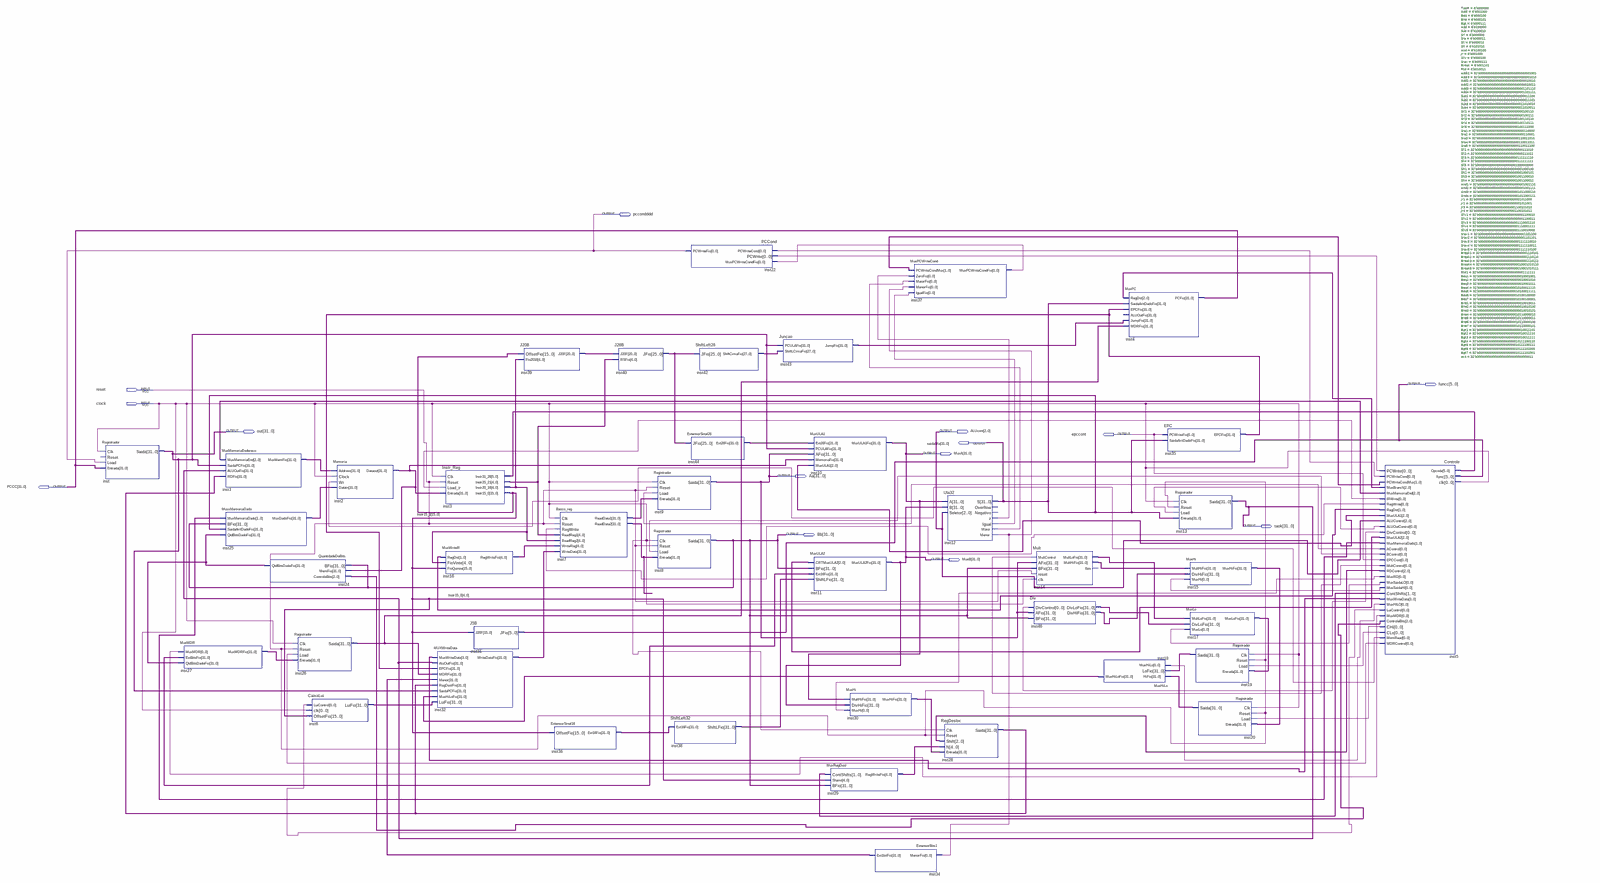
[diagram p0: schematic sheet, whole]
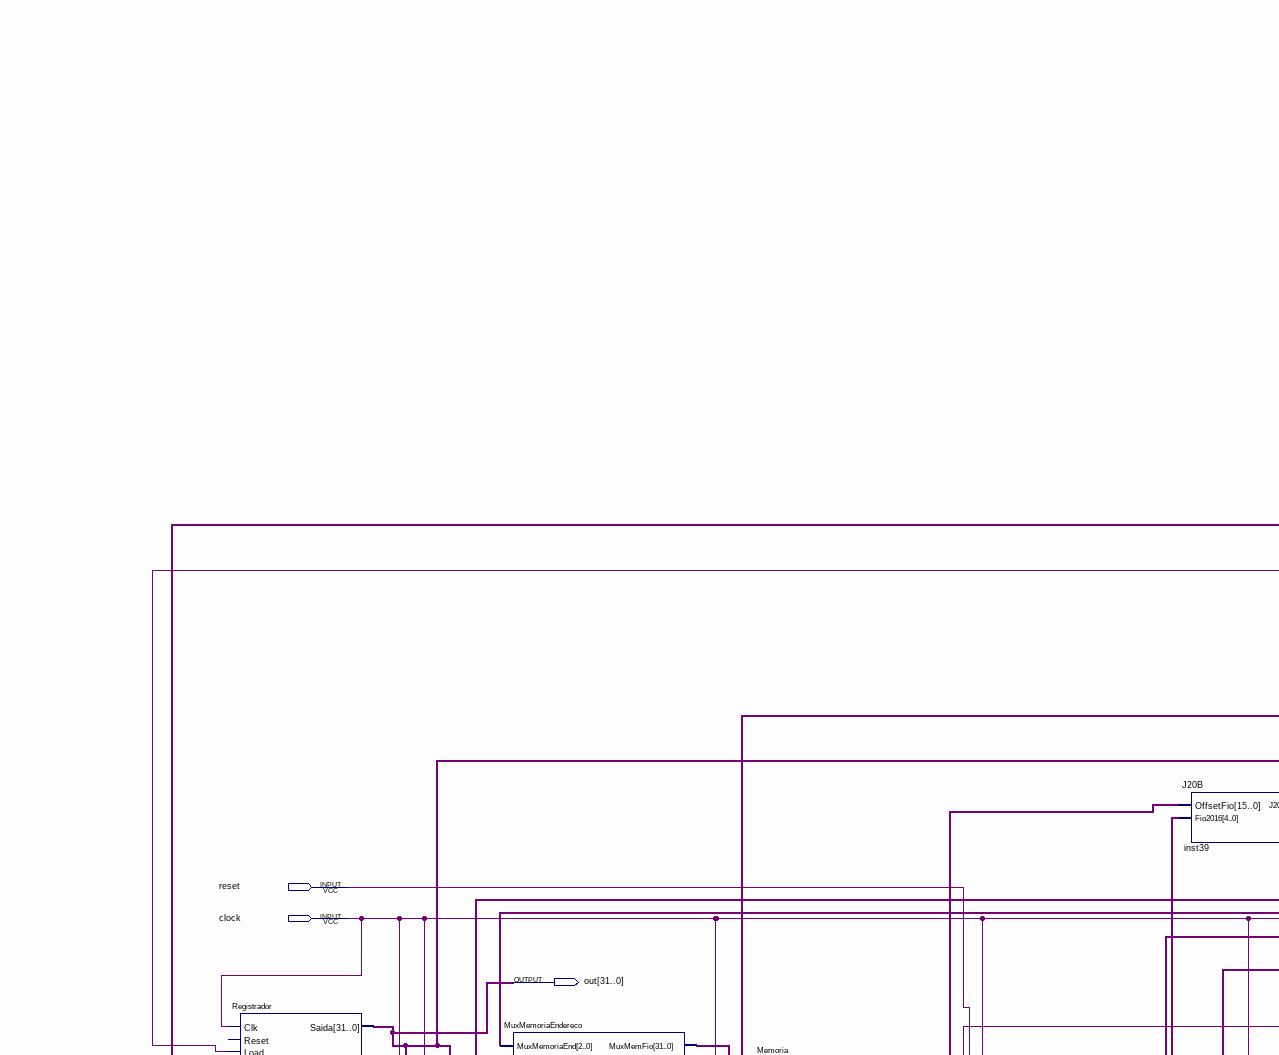
[diagram p1: schematic sheet, upper left part]
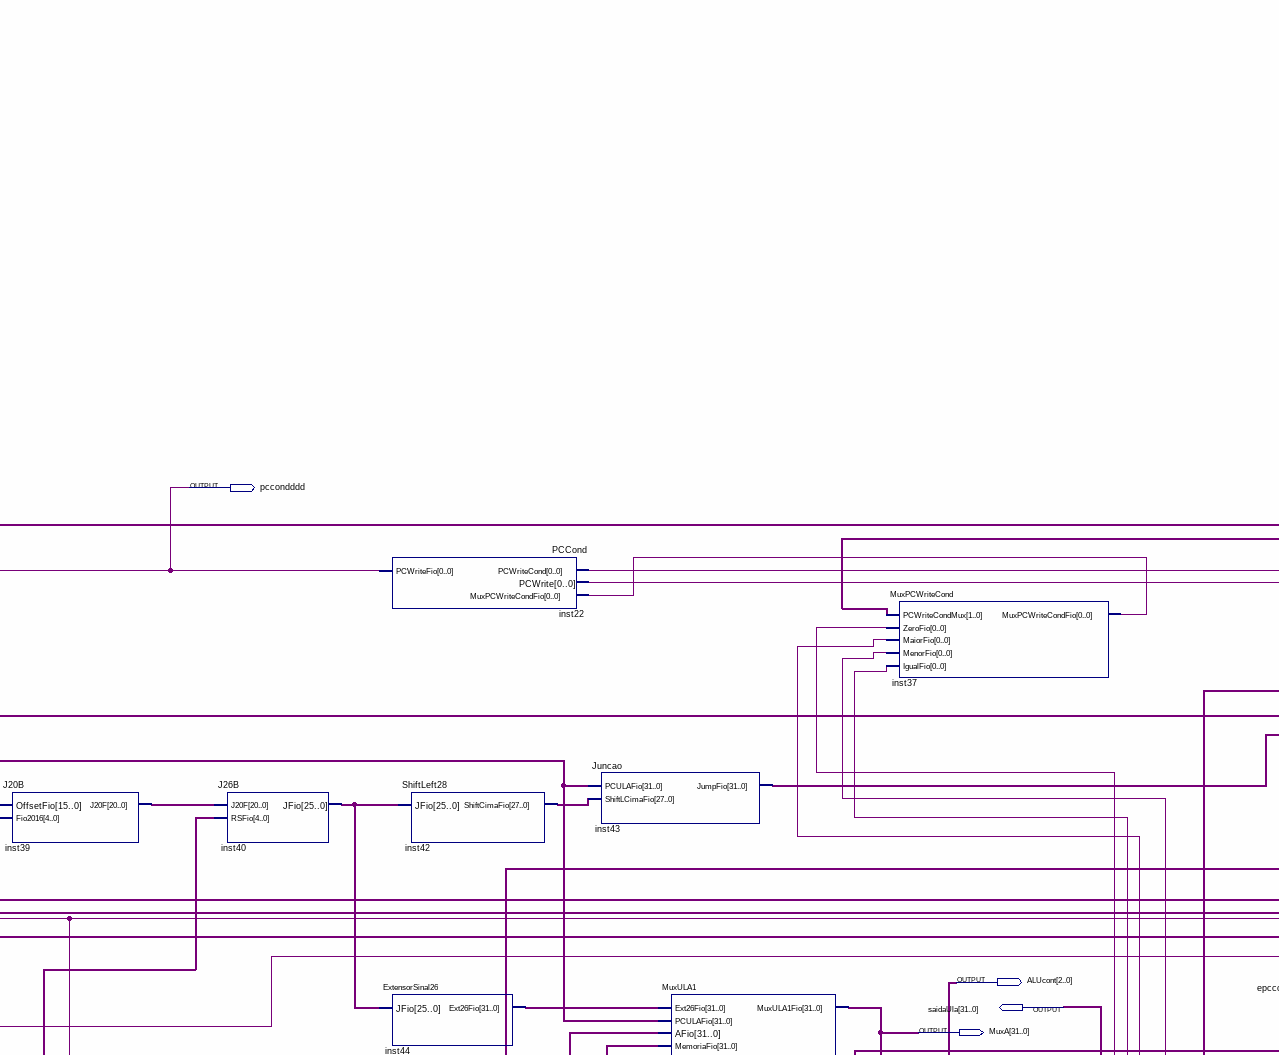
[diagram p2: schematic sheet, upper centre part]
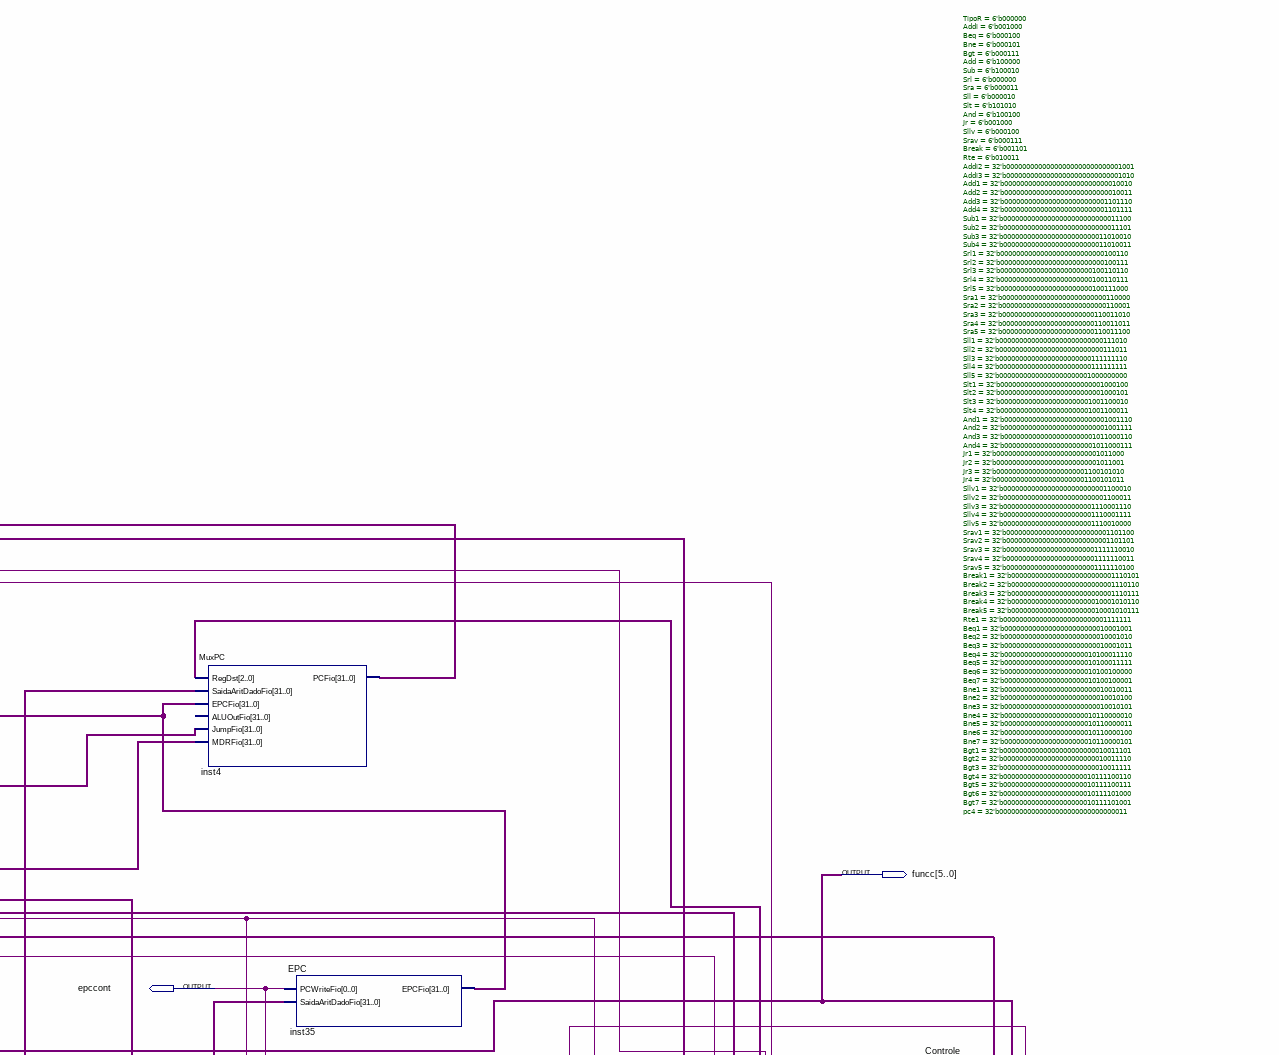
[diagram p3: schematic sheet, upper right part]
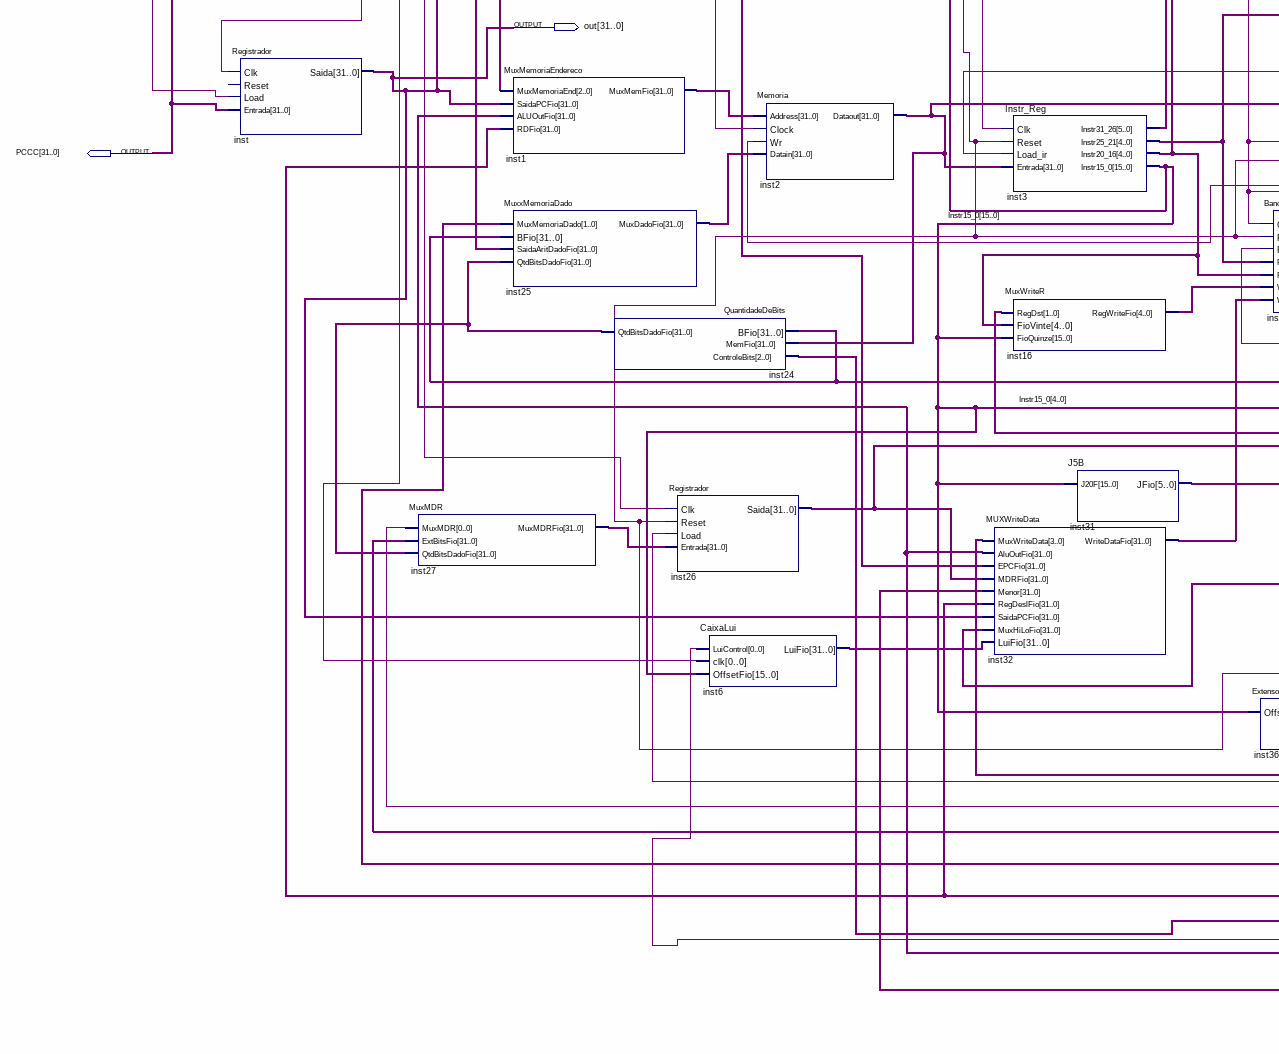
[diagram p4: schematic sheet, lower left part]
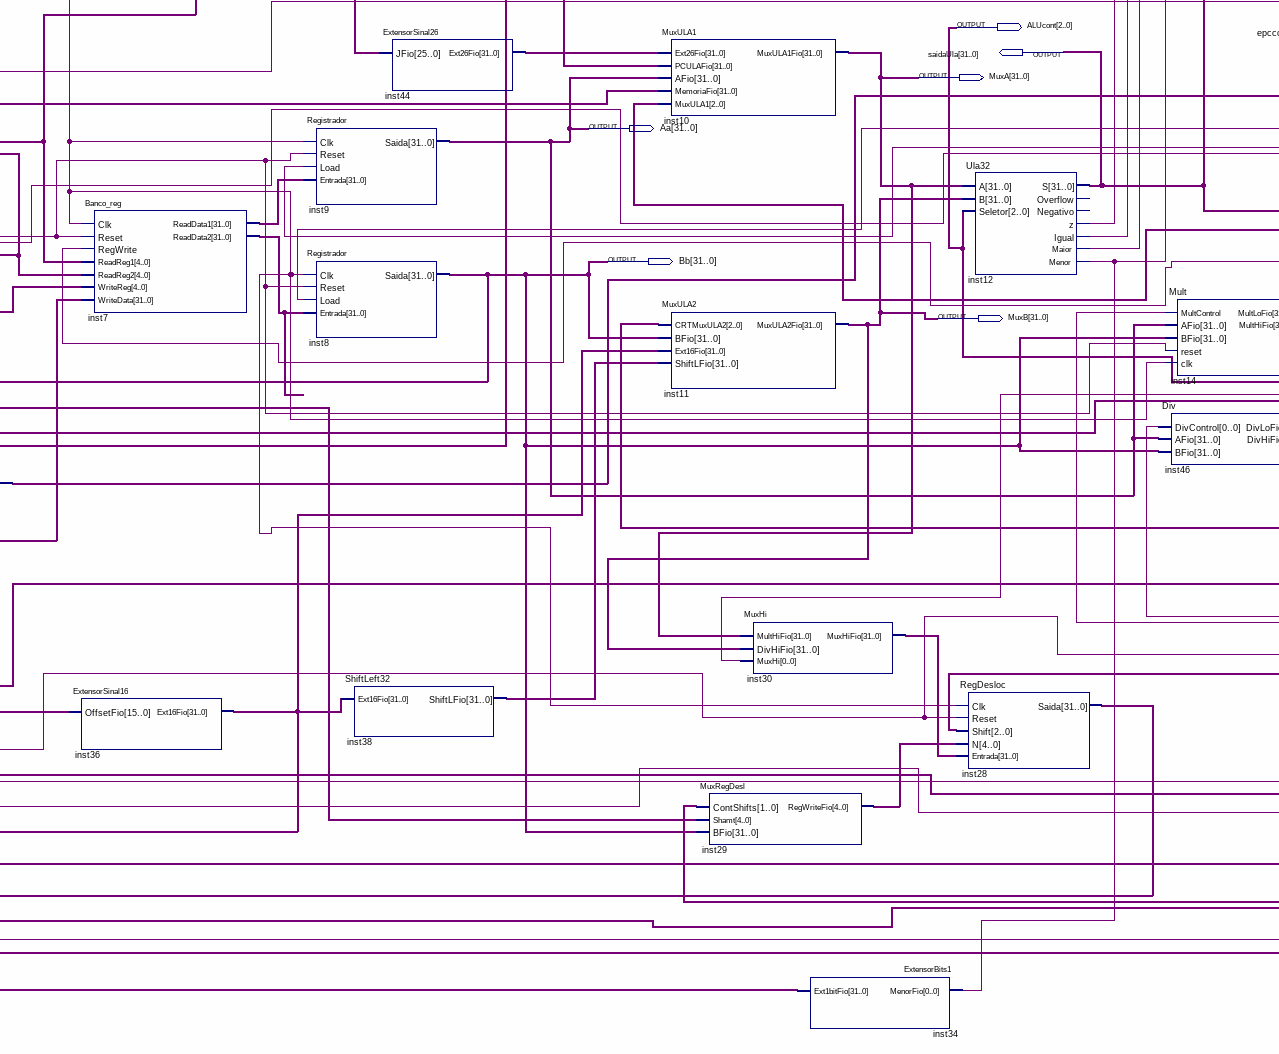
[diagram p5: schematic sheet, lower centre part]
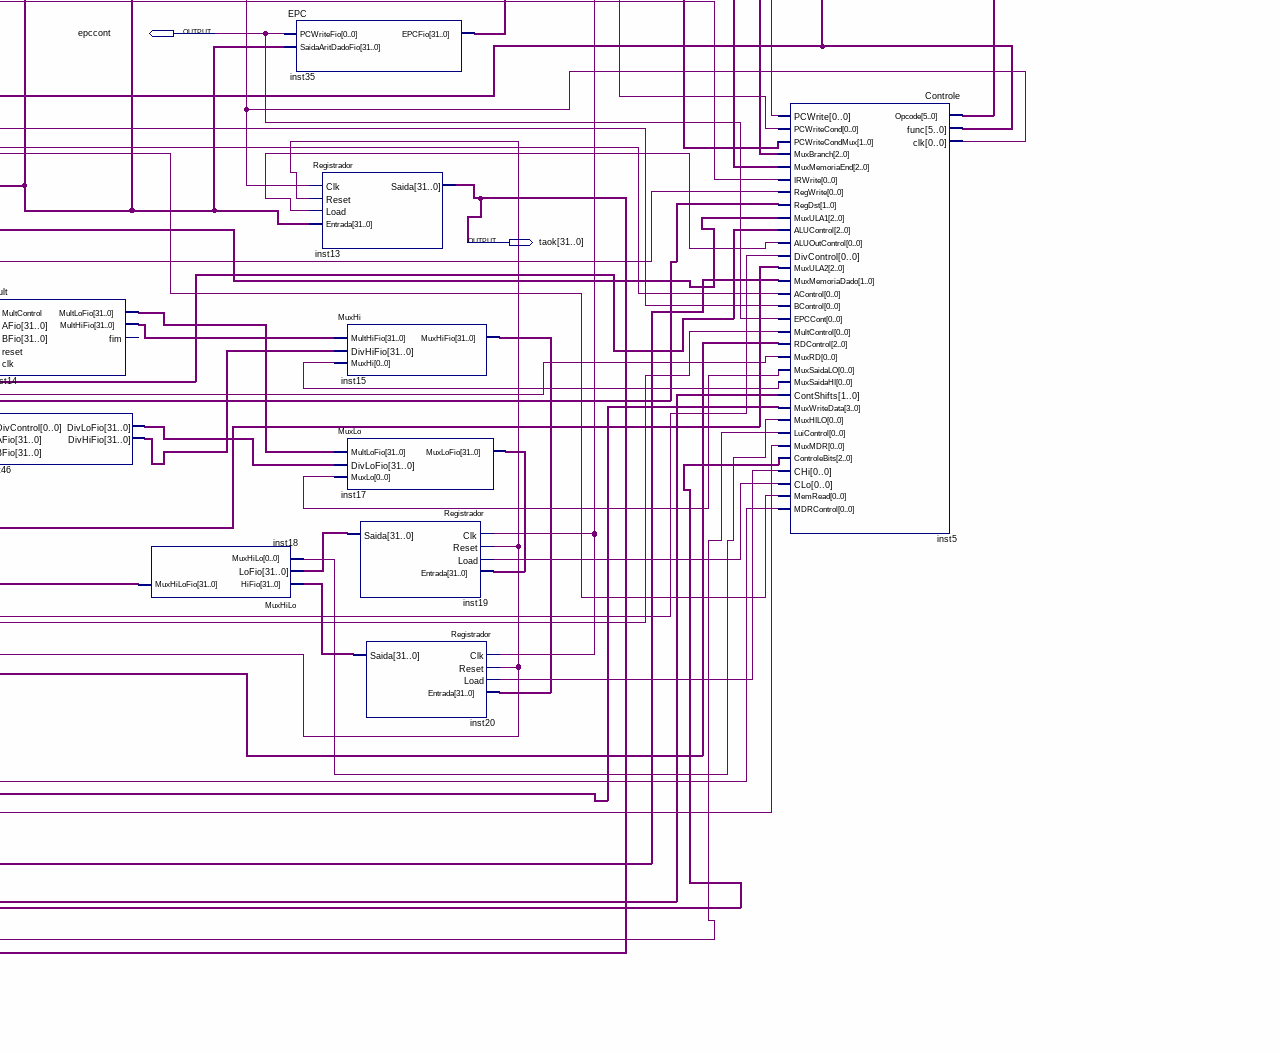
[diagram p6: schematic sheet, lower right part]
// Quartus schematic CPU.bdf as structural Verilog: 42 symbols, 14 pins
module CPU (
  input  reset,
  input  clock,
  output pccondddd,
  output [5:0] funcc,
  output [31:0] out,
  output [2:0] ALUcont,
  output epccont,
  output [31:0] saidaUla,
  output [31:0] MuxA,
  output [31:0] Aa,
  output [31:0] PCCC,
  output [31:0] taok,
  output [31:0] Bb,
  output [31:0] MuxB
);

  wire inst5_acontrol, inst5_aluoutcontrol, inst5_bcontrol, inst5_chi, inst5_clo, inst5_divcontrol,
       inst5_irwrite, inst5_luicontrol, inst5_mdrcontrol, inst5_memread, inst5_multcontrol, inst5_muxhilo,
       inst5_muxmdr, inst5_muxrd, inst5_muxsaidahi, inst5_muxsaidalo, inst5_pcwrite, inst5_pcwritecond,
       inst5_regwrite, inst12_igual, inst12_maior, inst12_menor, inst12_z, inst37_muxpcwritecondfio;
  wire [1:0] inst5_contshifts, inst5_muxmemoriadado, inst5_pcwritecondmux, inst5_regdst;
  wire [2:0] inst5_controlebits, inst5_muxbranch, inst5_muxmemoriaend, inst5_muxula1, inst5_muxula2,
       inst5_rdcontrol;
  wire [3:0] inst5_muxwritedata;
  wire [4:0] inst3_instr20_16, inst3_instr25_21, inst16_regwritefio, inst29_regwritefio;
  wire [5:0] inst3_instr31_26;
  wire [15:0] Instr15_0;
  wire [20:0] inst39_j20f;
  wire [25:0] inst40_jfio;
  wire [27:0] inst42_shiftcimafio;
  wire [31:0] inst1_muxmemfio, inst2_dataout, inst6_luifio, inst7_readdata1, inst7_readdata2,
       inst14_multhifio, inst14_multlofio, inst15_muxhifio, inst17_muxlofio, inst18_muxhilofio, inst19_saida,
       inst20_saida, inst24_qtdbitsdadofio, inst25_muxdadofio, inst26_saida, inst27_muxmdrfio, inst28_saida,
       inst30_muxhifio, inst32_writedatafio, inst34_ext1bitfio, inst35_epcfio, inst36_ext16fio,
       inst38_shiftlfio, inst43_jumpfio, inst44_ext26fio, inst46_divhifio, inst46_divlofio;

  Registrador inst (.Clk(clock), .Load(pccondddd), .Entrada(PCCC), .Saida(out));  // open: Reset
  MuxMDR inst27 (
    .MuxMDR(inst5_muxmdr), .ExtBitsFio(inst36_ext16fio), .QtdBitsDadoFio(inst24_qtdbitsdadofio),
    .MuxMDRFio(inst27_muxmdrfio));
  MuxMemoriaEndereco inst1 (
    .MuxMemoriaEnd(inst5_muxmemoriaend), .SaidaPCFio(out), .ALUOutFio(taok), .RDFio(inst28_saida),
    .MuxMemFio(inst1_muxmemfio));
  MuxxMemoriaDado inst25 (
    .MuxMemoriaDado(inst5_muxmemoriadado), .BFio(Bb), .SaidaAritDadoFio(saidaUla),
    .QtdBitsDadoFio(inst24_qtdbitsdadofio), .MuxDadoFio(inst25_muxdadofio));
  QuantidadeDeBits inst24 (
    .BFio(Bb), .MemFio(inst2_dataout), .ControleBits(inst5_controlebits),
    .QtdBitsDadoFio(inst24_qtdbitsdadofio));
  Registrador inst26 (
    .Clk(clock), .Reset(reset), .Load(inst5_mdrcontrol), .Entrada(inst27_muxmdrfio), .Saida(inst26_saida));
  CaixaLui inst6 (.LuiControl(inst5_luicontrol), .clk(clock), .OffsetFio(Instr15_0), .LuiFio(inst6_luifio));
  Memoria inst2 (
    .Address(inst1_muxmemfio), .Clock(clock), .Wr(inst5_memread), .Datain(inst25_muxdadofio),
    .Dataout(inst2_dataout));
  Instr_Reg inst3 (
    .Clk(clock), .Reset(reset), .Load_ir(inst5_irwrite), .Entrada(inst2_dataout),
    .Instr31_26(inst3_instr31_26), .Instr25_21(inst3_instr25_21), .Instr20_16(inst3_instr20_16),
    .Instr15_0(Instr15_0));
  MuxWriteR inst16 (
    .RegDst(inst5_regdst), .FioVinte(inst3_instr20_16), .FioQuinze(Instr15_0),
    .RegWriteFio(inst16_regwritefio));
  MUXWriteData inst32 (
    .MuxWriteData(inst5_muxwritedata), .AluOutFio(taok), .EPCFio(inst35_epcfio), .MDRFio(inst26_saida),
    .Menor(inst34_ext1bitfio), .RegDeslFio(inst28_saida), .SaidaPCFio(out), .MuxHiLoFio(inst18_muxhilofio),
    .LuiFio(inst6_luifio), .WriteDataFio(inst32_writedatafio));
  J5B inst31 (.J20F(Instr15_0), .JFio(funcc));
  J20B inst39 (.OffsetFio(Instr15_0), .Fio2016(inst3_instr20_16), .J20F(inst39_j20f));
  ExtensorSinal16 inst36 (.OffsetFio(Instr15_0), .Ext16Fio(inst36_ext16fio));
  Banco_reg inst7 (
    .Clk(clock), .Reset(reset), .RegWrite(inst5_regwrite), .ReadReg1(inst3_instr25_21),
    .ReadReg2(inst3_instr20_16), .WriteReg(inst16_regwritefio), .WriteData(inst32_writedatafio),
    .ReadData1(inst7_readdata1), .ReadData2(inst7_readdata2));
  J26B inst40 (.J20F(inst39_j20f), .RSFio(inst3_instr25_21), .JFio(inst40_jfio));
  Registrador inst9 (.Clk(clock), .Reset(reset), .Load(inst5_acontrol), .Entrada(inst7_readdata1), .Saida(Aa));
  Registrador inst8 (.Clk(clock), .Reset(reset), .Load(inst5_bcontrol), .Entrada(inst7_readdata2), .Saida(Bb));
  PCCond inst22 (
    .PCWriteCond(inst5_pcwritecond), .PCWrite(inst5_pcwrite), .MuxPCWriteCondFio(inst37_muxpcwritecondfio),
    .PCWriteFio(pccondddd));
  ExtensorSinal26 inst44 (.JFio(inst40_jfio), .Ext26Fio(inst44_ext26fio));
  ShiftLeft32 inst38 (.Ext16Fio(inst36_ext16fio), .ShiftLFio(inst38_shiftlfio));
  ShiftLeft28 inst42 (.JFio(inst40_jfio), .ShiftCimaFio(inst42_shiftcimafio));
  Juncao inst43 (.PCULAFio(out), .ShiftLCimaFio(inst42_shiftcimafio), .JumpFio(inst43_jumpfio));
  MuxULA1 inst10 (
    .Ext26Fio(inst44_ext26fio), .PCULAFio(out), .AFio(Aa), .MemoriaFio(inst2_dataout),
    .MuxULA1(inst5_muxula1), .MuxULA1Fio(MuxA));
  MuxULA2 inst11 (
    .CRTMuxULA2(inst5_muxula2), .BFio(Bb), .Ext16Fio(inst36_ext16fio), .ShiftLFio(inst38_shiftlfio),
    .MuxULA2Fio(MuxB));
  MuxRegDesl inst29 (
    .ContShifts(inst5_contshifts), .Shamt(Instr15_0[4:0]), .BFio(Bb), .RegWriteFio(inst29_regwritefio));
  MuxHi inst30 (.MultHiFio(MuxA), .DivHiFio(MuxB), .MuxHi(inst5_muxrd), .MuxHiFio(inst30_muxhifio));
  ExtensorBits1 inst34 (.MenorFio(inst12_menor), .Ext1bitFio(inst34_ext1bitfio));
  MuxPCWriteCond inst37 (
    .PCWriteCondMux(inst5_pcwritecondmux), .ZeroFio(inst12_z), .MaiorFio(inst12_maior),
    .MenorFio(inst12_menor), .IgualFio(inst12_igual), .MuxPCWriteCondFio(inst37_muxpcwritecondfio));
  Ula32 inst12 (
    .A(MuxA), .B(MuxB), .Seletor(ALUcont), .S(saidaUla), .z(inst12_z), .Igual(inst12_igual),
    .Maior(inst12_maior), .Menor(inst12_menor));  // open: Overflow, Negativo
  RegDesloc inst28 (
    .Clk(clock), .Reset(reset), .Shift(inst5_rdcontrol), .N(inst29_regwritefio), .Entrada(inst30_muxhifio),
    .Saida(inst28_saida));
  Mult inst14 (
    .MultControl(inst5_multcontrol), .AFio(Aa), .BFio(Bb), .reset(reset), .clk(clock),
    .MultLoFio(inst14_multlofio), .MultHiFio(inst14_multhifio));  // open: fim
  Div inst46 (
    .DivControl(inst5_divcontrol), .AFio(Aa), .BFio(Bb), .DivLoFio(inst46_divlofio),
    .DivHiFio(inst46_divhifio));
  MuxHiLo inst18 (.HiFio(inst20_saida), .LoFio(inst19_saida), .MuxHiLo(inst5_muxhilo), .MuxHiLoFio(inst18_muxhilofio));
  MuxPC inst4 (
    .RegDst(inst5_muxbranch), .SaidaAritDadoFio(saidaUla), .EPCFio(inst35_epcfio), .JumpFio(inst43_jumpfio),
    .MDRFio(inst26_saida), .PCFio(PCCC));  // open: ALUOutFio
  EPC inst35 (.PCWriteFio(epccont), .SaidaAritDadoFio(saidaUla), .EPCFio(inst35_epcfio));
  Registrador inst13 (.Clk(clock), .Reset(reset), .Load(inst5_aluoutcontrol), .Entrada(saidaUla), .Saida(taok));
  MuxHi inst15 (
    .MultHiFio(inst14_multhifio), .DivHiFio(inst46_divhifio), .MuxHi(inst5_muxsaidahi),
    .MuxHiFio(inst15_muxhifio));
  MuxLo inst17 (
    .MultLoFio(inst14_multlofio), .DivLoFio(inst46_divlofio), .MuxLo(inst5_muxsaidalo),
    .MuxLoFio(inst17_muxlofio));
  Registrador inst19 (.Clk(clock), .Reset(reset), .Load(inst5_clo), .Entrada(inst17_muxlofio), .Saida(inst19_saida));
  Registrador inst20 (.Clk(clock), .Reset(reset), .Load(inst5_chi), .Entrada(inst15_muxhifio), .Saida(inst20_saida));
  Controle #(.TipoR(6'b000000), .Addi(6'b001000), .Beq(6'b000100), .Bne(6'b000101), .Bgt(6'b000111), .Add(6'b100000), .Sub(6'b100010), .Srl(6'b000000), .Sra(6'b000011), .Sll(6'b000010), .Slt(6'b101010), .And(6'b100100), .Jr(6'b001000), .Sllv(6'b000100), .Srav(6'b000111), .Break(6'b001101), .Rte(6'b010011), .Addi2(32'b00000000000000000000000000001001), .Addi3(32'b00000000000000000000000000001010), .Add1(32'b00000000000000000000000000010010), .Add2(32'b00000000000000000000000000010011), .Add3(32'b00000000000000000000000001101110), .Add4(32'b00000000000000000000000001101111), .Sub1(32'b00000000000000000000000000011100), .Sub2(32'b00000000000000000000000000011101), .Sub3(32'b00000000000000000000000011010010), .Sub4(32'b00000000000000000000000011010011), .Srl1(32'b00000000000000000000000000100110), .Srl2(32'b00000000000000000000000000100111), .Srl3(32'b00000000000000000000000100110110), .Srl4(32'b00000000000000000000000100110111), .Srl5(32'b00000000000000000000000100111000), .Sra1(32'b00000000000000000000000000110000), .Sra2(32'b00000000000000000000000000110001), .Sra3(32'b00000000000000000000000110011010), .Sra4(32'b00000000000000000000000110011011), .Sra5(32'b00000000000000000000000110011100), .Sll1(32'b00000000000000000000000000111010), .Sll2(32'b00000000000000000000000000111011), .Sll3(32'b00000000000000000000000111111110), .Sll4(32'b00000000000000000000000111111111), .Sll5(32'b00000000000000000000001000000000), .Slt1(32'b00000000000000000000000001000100), .Slt2(32'b00000000000000000000000001000101), .Slt3(32'b00000000000000000000001001100010), .Slt4(32'b00000000000000000000001001100011), .And1(32'b00000000000000000000000001001110), .And2(32'b00000000000000000000000001001111), .And3(32'b00000000000000000000001011000110), .And4(32'b00000000000000000000001011000111), .Jr1(32'b00000000000000000000000001011000), .Jr2(32'b00000000000000000000000001011001), .Jr3(32'b00000000000000000000001100101010), .Jr4(32'b00000000000000000000001100101011), .Sllv1(32'b00000000000000000000000001100010), .Sllv2(32'b00000000000000000000000001100011), .Sllv3(32'b00000000000000000000001110001110), .Sllv4(32'b00000000000000000000001110001111), .Sllv5(32'b00000000000000000000001110010000), .Srav1(32'b00000000000000000000000001101100), .Srav2(32'b00000000000000000000000001101101), .Srav3(32'b00000000000000000000001111110010), .Srav4(32'b00000000000000000000001111110011), .Srav5(32'b00000000000000000000001111110100), .Break1(32'b00000000000000000000000001110101), .Break2(32'b00000000000000000000000001110110), .Break3(32'b00000000000000000000000001110111), .Break4(32'b00000000000000000000010001010110), .Break5(32'b00000000000000000000010001010111), .Rte1(32'b00000000000000000000000001111111), .Beq1(32'b00000000000000000000000010001001), .Beq2(32'b00000000000000000000000010001010), .Beq3(32'b00000000000000000000000010001011), .Beq4(32'b00000000000000000000010100011110), .Beq5(32'b00000000000000000000010100011111), .Beq6(32'b00000000000000000000010100100000), .Beq7(32'b00000000000000000000010100100001), .Bne1(32'b00000000000000000000000010010011), .Bne2(32'b00000000000000000000000010010100), .Bne3(32'b00000000000000000000000010010101), .Bne4(32'b00000000000000000000010110000010), .Bne5(32'b00000000000000000000010110000011), .Bne6(32'b00000000000000000000010110000100), .Bne7(32'b00000000000000000000010110000101), .Bgt1(32'b00000000000000000000000010011101), .Bgt2(32'b00000000000000000000000010011110), .Bgt3(32'b00000000000000000000000010011111), .Bgt4(32'b00000000000000000000010111100110), .Bgt5(32'b00000000000000000000010111100111), .Bgt6(32'b00000000000000000000010111101000), .Bgt7(32'b00000000000000000000010111101001), .pc4(32'b00000000000000000000000000000011)) inst5 (
    .Opcode(inst3_instr31_26), .func(funcc), .clk(clock), .PCWrite(inst5_pcwrite),
    .PCWriteCond(inst5_pcwritecond), .PCWriteCondMux(inst5_pcwritecondmux), .MuxBranch(inst5_muxbranch),
    .MuxMemoriaEnd(inst5_muxmemoriaend), .IRWrite(inst5_irwrite), .RegWrite(inst5_regwrite),
    .RegDst(inst5_regdst), .MuxULA1(inst5_muxula1), .ALUControl(ALUcont),
    .ALUOutControl(inst5_aluoutcontrol), .DivControl(inst5_divcontrol), .MuxULA2(inst5_muxula2),
    .MuxMemoriaDado(inst5_muxmemoriadado), .AControl(inst5_acontrol), .BControl(inst5_bcontrol),
    .EPCCont(epccont), .MultControl(inst5_multcontrol), .RDControl(inst5_rdcontrol), .MuxRD(inst5_muxrd),
    .MuxSaidaLO(inst5_muxsaidalo), .MuxSaidaHI(inst5_muxsaidahi), .ContShifts(inst5_contshifts),
    .MuxWriteData(inst5_muxwritedata), .MuxHILO(inst5_muxhilo), .LuiControl(inst5_luicontrol),
    .MuxMDR(inst5_muxmdr), .ControleBits(inst5_controlebits), .CHi(inst5_chi), .CLo(inst5_clo),
    .MemRead(inst5_memread), .MDRControl(inst5_mdrcontrol));
endmodule
